# EAGLE design I2CHubMultiplexer (EAGLE 8.4.0)
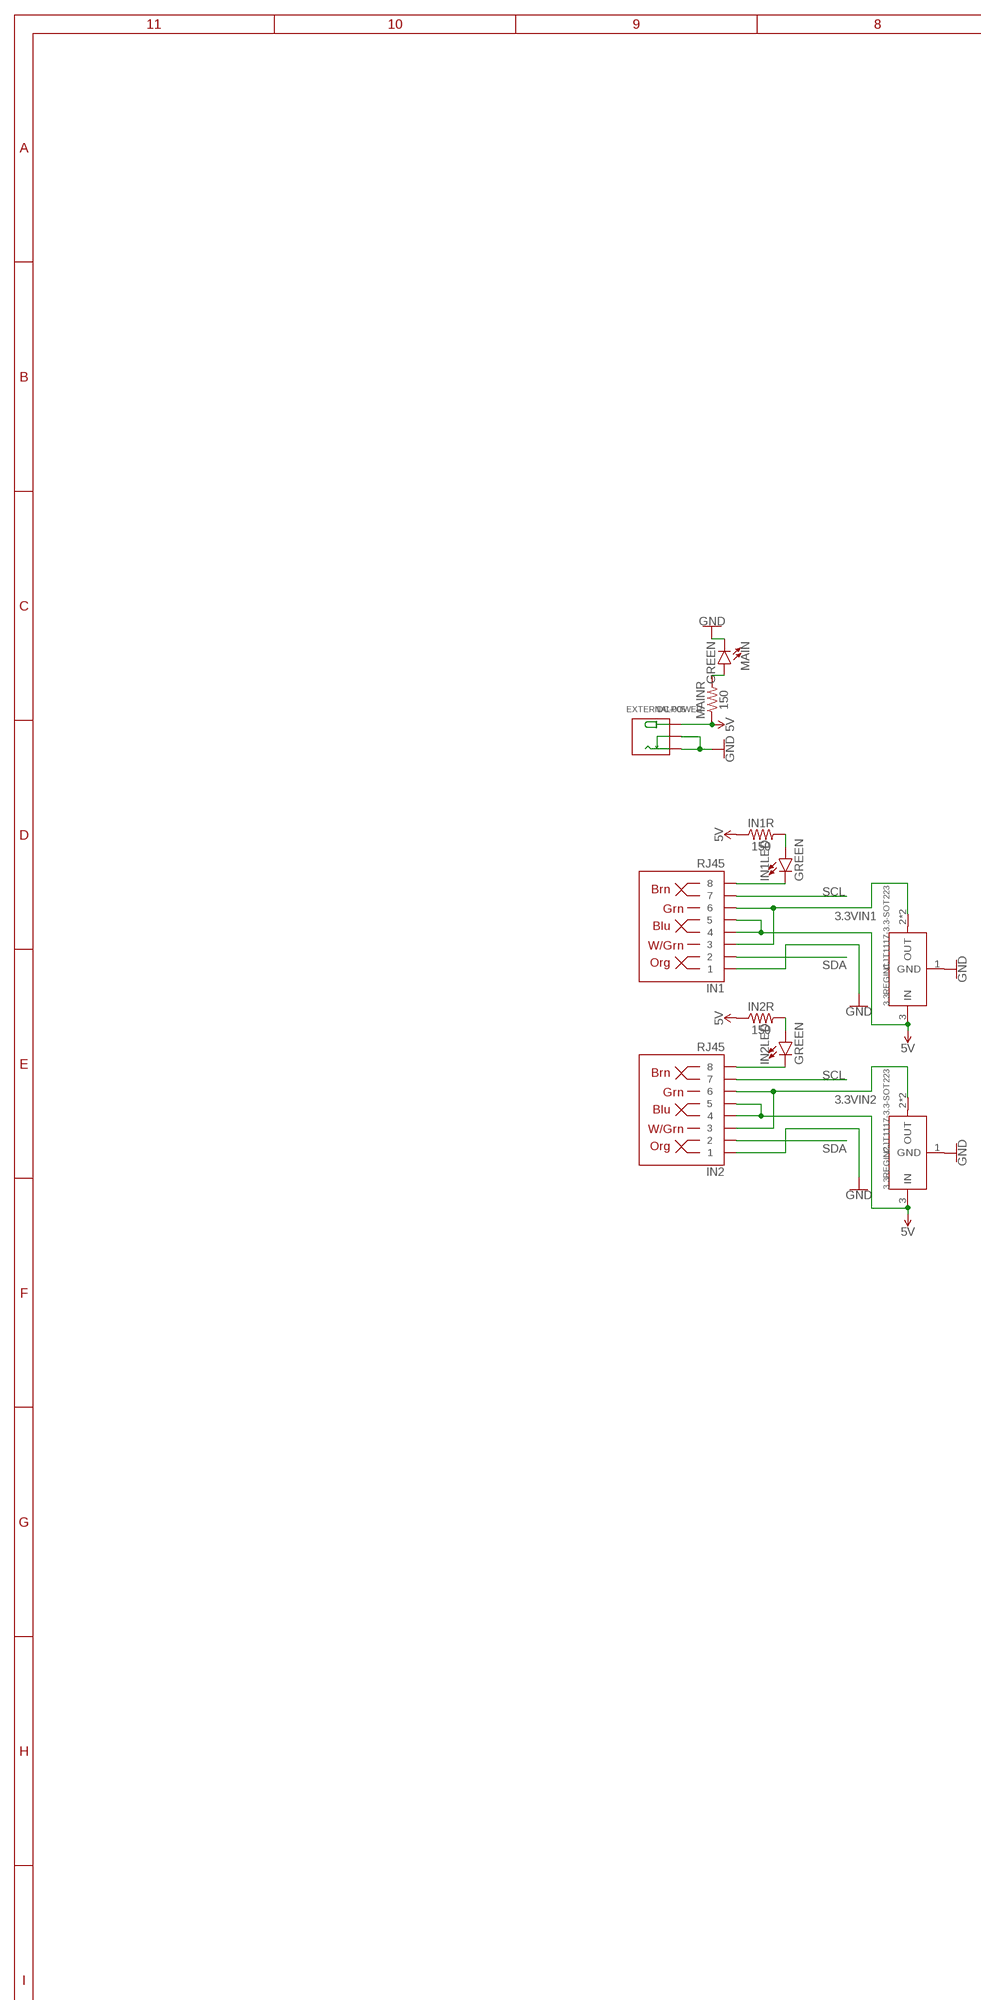
[diagram p0: schematic, sheet 1, part 1 of 2]
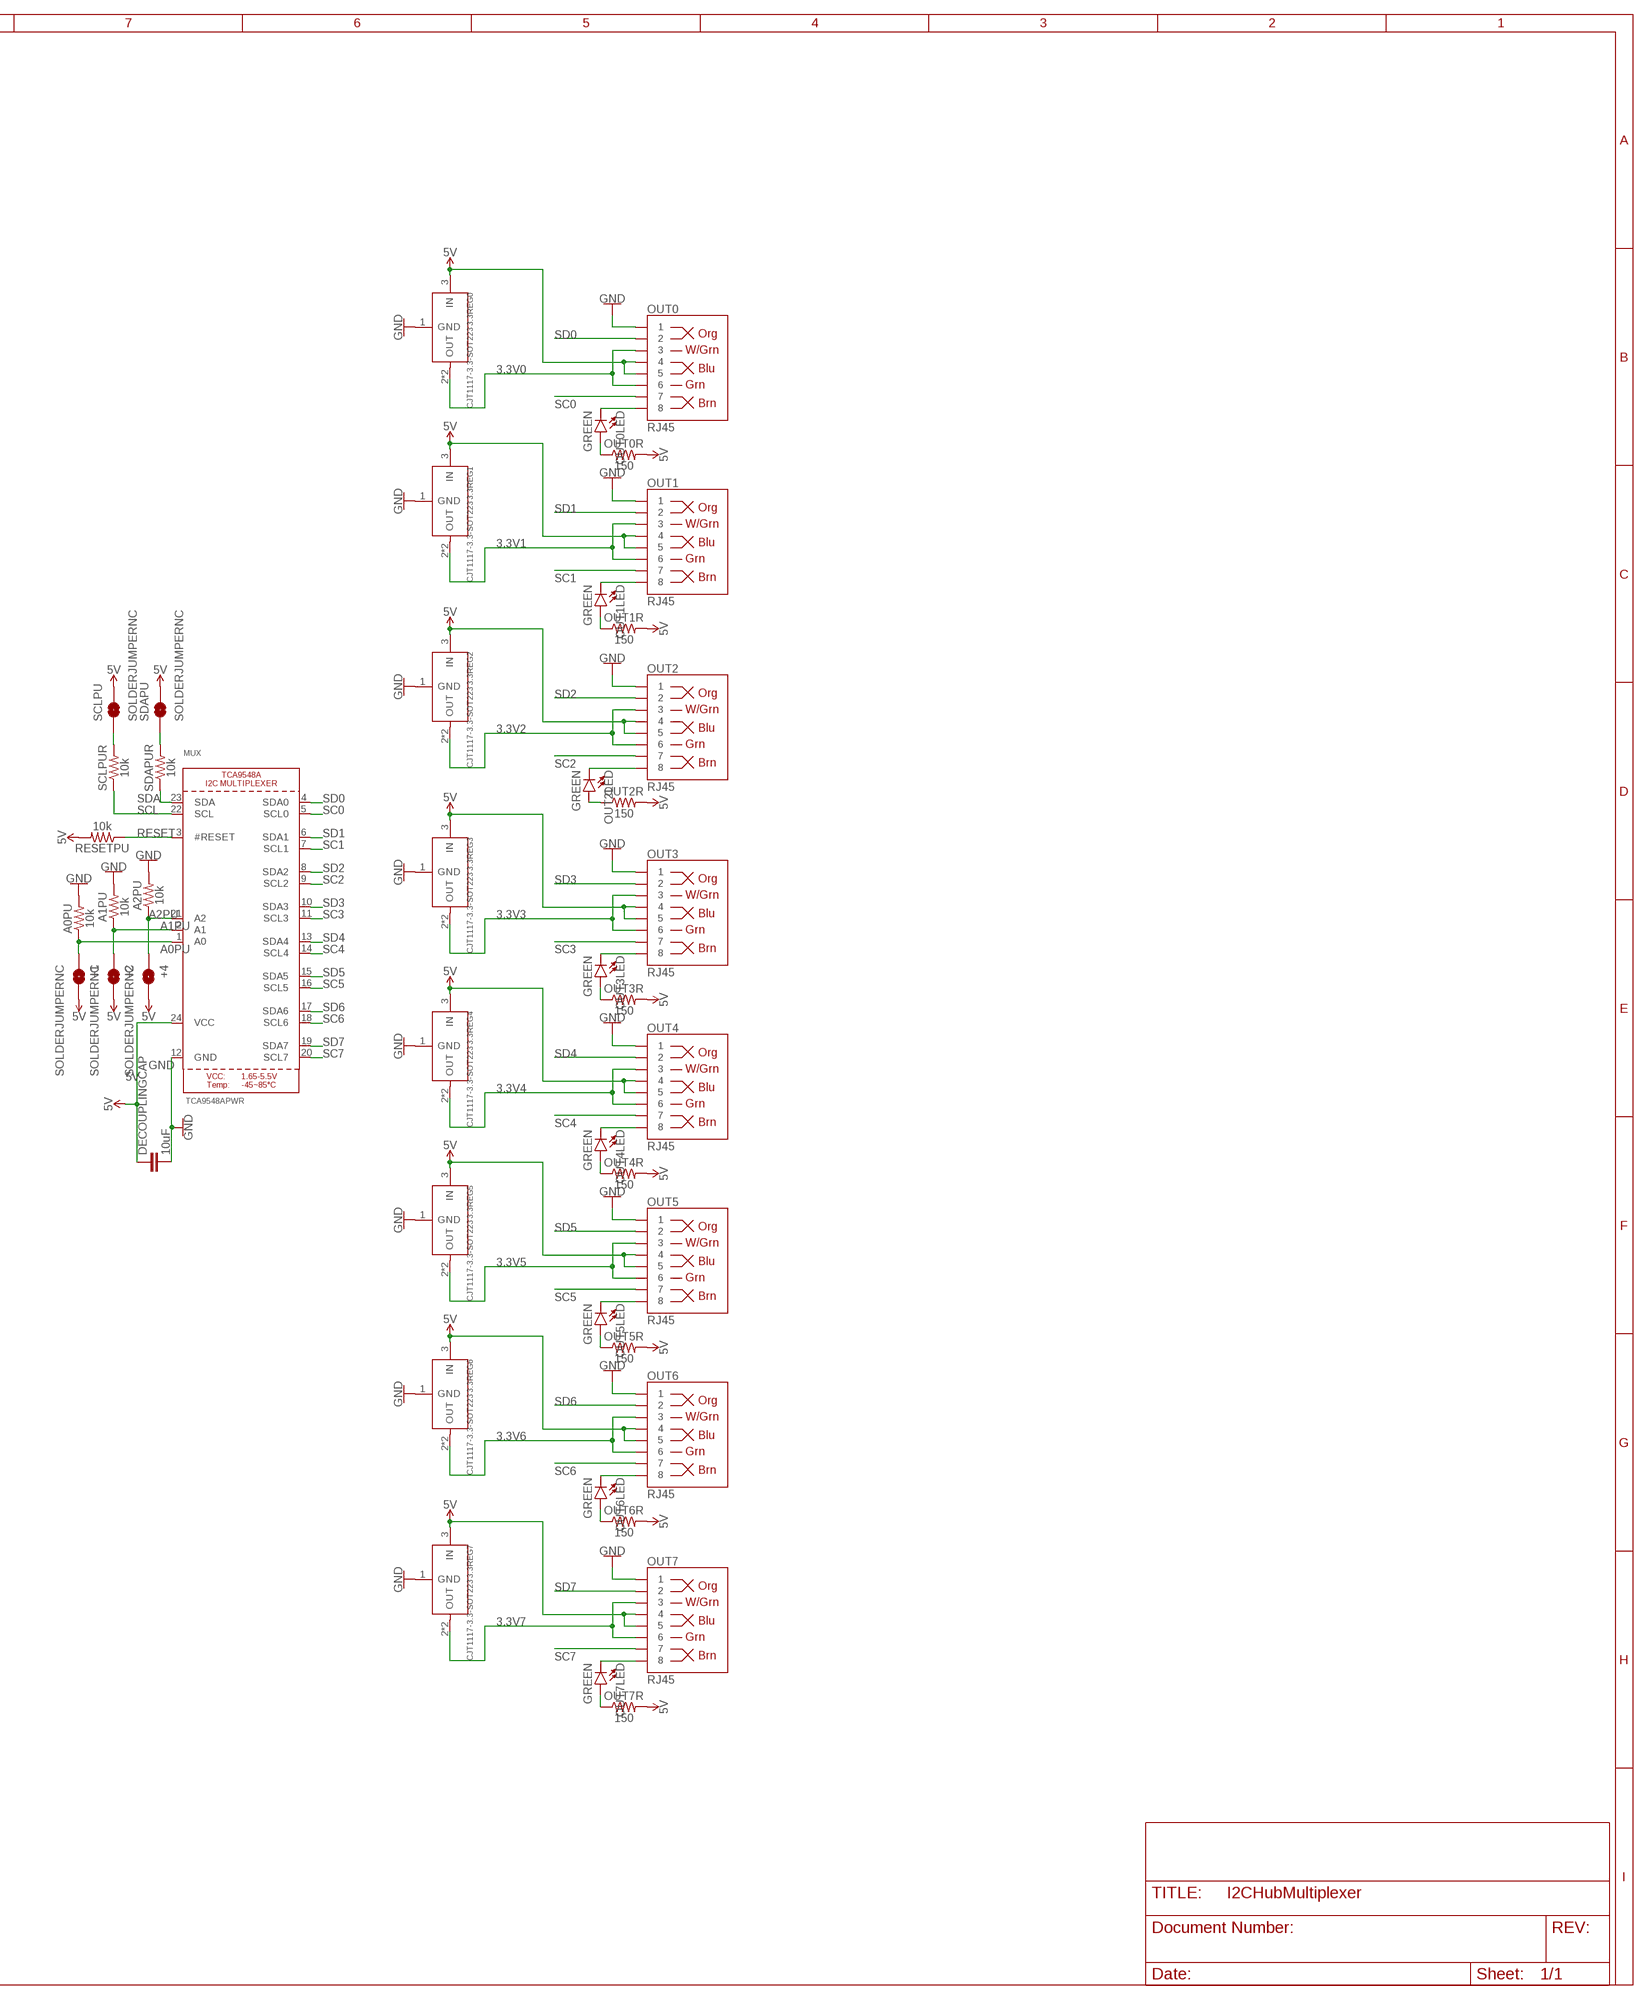
[diagram p1: schematic, sheet 1, part 2 of 2]

## Parts
3.3REG0  CJT1117-3.3-SOT223  PMIC-CJT1117-3.3(SOT223)  [SOT-223]
3.3REG1  CJT1117-3.3-SOT223  PMIC-CJT1117-3.3(SOT223)  [SOT-223]
3.3REG2  CJT1117-3.3-SOT223  PMIC-CJT1117-3.3(SOT223)  [SOT-223]
3.3REG3  CJT1117-3.3-SOT223  PMIC-CJT1117-3.3(SOT223)  [SOT-223]
3.3REG4  CJT1117-3.3-SOT223  PMIC-CJT1117-3.3(SOT223)  [SOT-223]
3.3REG5  CJT1117-3.3-SOT223  PMIC-CJT1117-3.3(SOT223)  [SOT-223]
3.3REG6  CJT1117-3.3-SOT223  PMIC-CJT1117-3.3(SOT223)  [SOT-223]
3.3REG7  CJT1117-3.3-SOT223  PMIC-CJT1117-3.3(SOT223)  [SOT-223]
3.3REGIN1  CJT1117-3.3-SOT223  PMIC-CJT1117-3.3(SOT223)  [SOT-223]
3.3REGIN2  CJT1117-3.3-SOT223  PMIC-CJT1117-3.3(SOT223)  [SOT-223]
+1  SOLDERJUMPERNC  [SJ_2S]
+2  SOLDERJUMPERNC  [SJ_2S]
+4  SOLDERJUMPERNC  [SJ_2S]
A0PU  10k  10KOHM-0603-1/10W-1%  [0603]
A1PU  10k  10KOHM-0603-1/10W-1%  [0603]
A2PU  10k  10KOHM-0603-1/10W-1%  [0603]
DECOUPLINGCAP  10uF  10UF-0603-6.3V-20%  [0603]
EXTERNALPOWER  DC-005  CONN-POWER-JACK-2.1MM(DC-005)  [DCJ3P-14.2X11.0X9.0MM]
IN1  RJ45  RJ45-8  [RJ45-8]
IN1LED  GREEN  LED-GREEN0603  [LED-0603]
IN1R  150  150OHM-0603-1/10W-1%  [0603]
IN2  RJ45  RJ45-8  [RJ45-8]
IN2LED  GREEN  LED-GREEN0603  [LED-0603]
IN2R  150  150OHM-0603-1/10W-1%  [0603]
MAIN  GREEN  LED-GREEN0603  [LED-0603]
MAINR  150  150OHM-0603-1/10W-1%  [0603]
MUX  TCA9548APWR  TCA9548A  [TSSOP24]
OUT0  RJ45  RJ45-8  [RJ45-8]
OUT0LED  GREEN  LED-GREEN0603  [LED-0603]
OUT0R  150  150OHM-0603-1/10W-1%  [0603]
OUT1  RJ45  RJ45-8  [RJ45-8]
OUT1LED  GREEN  LED-GREEN0603  [LED-0603]
OUT1R  150  150OHM-0603-1/10W-1%  [0603]
OUT2  RJ45  RJ45-8  [RJ45-8]
OUT2LED  GREEN  LED-GREEN0603  [LED-0603]
OUT2R  150  150OHM-0603-1/10W-1%  [0603]
OUT3  RJ45  RJ45-8  [RJ45-8]
OUT3LED  GREEN  LED-GREEN0603  [LED-0603]
OUT3R  150  150OHM-0603-1/10W-1%  [0603]
OUT4  RJ45  RJ45-8  [RJ45-8]
OUT4LED  GREEN  LED-GREEN0603  [LED-0603]
OUT4R  150  150OHM-0603-1/10W-1%  [0603]
OUT5  RJ45  RJ45-8  [RJ45-8]
OUT5LED  GREEN  LED-GREEN0603  [LED-0603]
OUT5R  150  150OHM-0603-1/10W-1%  [0603]
OUT6  RJ45  RJ45-8  [RJ45-8]
OUT6LED  GREEN  LED-GREEN0603  [LED-0603]
OUT6R  150  150OHM-0603-1/10W-1%  [0603]
OUT7  RJ45  RJ45-8  [RJ45-8]
OUT7LED  GREEN  LED-GREEN0603  [LED-0603]
OUT7R  150  150OHM-0603-1/10W-1%  [0603]
RESETPU  10k  10KOHM-0603-1/10W-1%  [0603]
SCLPU  SOLDERJUMPERNC  [SJ_2S]
SCLPUR  10k  10KOHM-0603-1/10W-1%  [0603]
SDAPU  SOLDERJUMPERNC  [SJ_2S]
SDAPUR  10k  10KOHM-0603-1/10W-1%  [0603]

## Nets
3.3V0: 3.3REG0.2(OUT) 3.3REG0.TER(OUT) OUT0.3 OUT0.6
3.3V1: 3.3REG1.2(OUT) 3.3REG1.TER(OUT) OUT1.3 OUT1.6
3.3V2: 3.3REG2.2(OUT) 3.3REG2.TER(OUT) OUT2.3 OUT2.6
3.3V3: 3.3REG3.2(OUT) 3.3REG3.TER(OUT) OUT3.3 OUT3.6
3.3V4: 3.3REG4.2(OUT) 3.3REG4.TER(OUT) OUT4.3 OUT4.6
3.3V5: 3.3REG5.2(OUT) 3.3REG5.TER(OUT) OUT5.3 OUT5.6
3.3V6: 3.3REG6.2(OUT) 3.3REG6.TER(OUT) OUT6.3 OUT6.6
3.3V7: 3.3REG7.2(OUT) 3.3REG7.TER(OUT) OUT7.3 OUT7.6
3.3VIN1: 3.3REGIN1.2(OUT) 3.3REGIN1.TER(OUT) IN1.3 IN1.6
3.3VIN2: 3.3REGIN2.2(OUT) 3.3REGIN2.TER(OUT) IN2.3 IN2.6
5V: 3.3REG0.3(IN) 3.3REG1.3(IN) 3.3REG2.3(IN) 3.3REG3.3(IN) 3.3REG4.3(IN) 3.3REG5.3(IN) 3.3REG6.3(IN) 3.3REG7.3(IN) 3.3REGIN1.3(IN) 3.3REGIN2.3(IN) +1.2 +2.2 +4.2 DECOUPLINGCAP.1 EXTERNALPOWER.+ IN1.4 IN1.5 IN1R.1 IN2.4 IN2.5 IN2R.1 MAINR.1 MUX.24(VCC) OUT0.4 OUT0.5 OUT0R.2 OUT1.4 OUT1.5 OUT1R.2 OUT2.4 OUT2.5 OUT2R.2 OUT3.4 OUT3.5 OUT3R.2 OUT4.4 OUT4.5 OUT4R.2 OUT5.4 OUT5.5 OUT5R.2 OUT6.4 OUT6.5 OUT6R.2 OUT7.4 OUT7.5 OUT7R.2 RESETPU.2 SCLPU.2 SDAPU.2
A0PU: +1.1 A0PU.1 MUX.1(A0)
A1PU: +2.1 A1PU.1 MUX.2(A1)
A2PU: +4.1 A2PU.1 MUX.21(A2)
GND: 3.3REG0.1(GND) 3.3REG1.1(GND) 3.3REG2.1(GND) 3.3REG3.1(GND) 3.3REG4.1(GND) 3.3REG5.1(GND) 3.3REG6.1(GND) 3.3REG7.1(GND) 3.3REGIN1.1(GND) 3.3REGIN2.1(GND) A0PU.2 A1PU.2 A2PU.2 DECOUPLINGCAP.2 EXTERNALPOWER.-1(-) EXTERNALPOWER.-2(CDN) IN1.1 IN2.1 MAIN.C MUX.12(GND) OUT0.1 OUT1.1 OUT2.1 OUT3.1 OUT4.1 OUT5.1 OUT6.1 OUT7.1
IN1LEDR: IN1LED.A IN1R.2
IN2LEDR: IN2LED.A IN2R.2
MAINLEDR: MAIN.A MAINR.2
OU1LEDR: OUT1LED.A OUT1R.1
OUT0LEDR: OUT0LED.A OUT0R.1
OUT2LEDR: OUT2LED.A OUT2R.1
OUT3LEDR: OUT3LED.A OUT3R.1
OUT4LEDR: OUT4LED.A OUT4R.1
OUT5LEDR: OUT5LED.A OUT5R.1
OUT6LEDR: OUT6LED.A OUT6R.1
OUT7LEDR: OUT7LED.A OUT7R.1
RESET: MUX.3(#RESET) RESETPU.1
RETRUNGNDIN1: IN1.8 IN1LED.C
RETURNGNDIN2: IN2.8 IN2LED.C
RETURNGNDOUT1: OUT1.8 OUT1LED.C
RETURNGNDOUT2: OUT2.8 OUT2LED.C
RETURNGNDOUT3: OUT3.8 OUT3LED.C
RETURNGNDOUT4: OUT4.8 OUT4LED.C
RETURNGNDOUT5: OUT5.8 OUT5LED.C
RETURNGNDOUT6: OUT6.8 OUT6LED.C
RETURNGNDOUT7: OUT7.8 OUT7LED.C
RETURNGRNDOUT0: OUT0.8 OUT0LED.C
SC0: MUX.5(SCL0) OUT0.7
SC1: MUX.7(SCL1) OUT1.7
SC2: MUX.9(SCL2) OUT2.7
SC3: MUX.11(SCL3) OUT3.7
SC4: MUX.14(SCL4) OUT4.7
SC5: MUX.16(SCL5) OUT5.7
SC6: MUX.18(SCL6) OUT6.7
SC7: MUX.20(SCL7) OUT7.7
SCL: IN1.7 IN2.7 MUX.22(SCL) SCLPUR.1
SCLPU: SCLPU.1 SCLPUR.2
SD0: MUX.4(SDA0) OUT0.2
SD1: MUX.6(SDA1) OUT1.2
SD2: MUX.8(SDA2) OUT2.2
SD3: MUX.10(SDA3) OUT3.2
SD4: MUX.13(SDA4) OUT4.2
SD5: MUX.15(SDA5) OUT5.2
SD6: MUX.17(SDA6) OUT6.2
SD7: MUX.19(SDA7) OUT7.2
SDA: IN1.2 IN2.2 MUX.23(SDA) SDAPUR.1
SDAPU: SDAPU.1 SDAPUR.2

## Library data of the parts
3.3REG0 3.3REG1-3.3REG7 3.3REGIN1 3.3REGIN2 = Seeed-IC:PMIC-CJT1117-3.3(SOT223): 310030097; MPN: CJT1117-3.3
+1 +2 +4 SCLPU SDAPU = SparkFun-Retired:SOLDERJUMPER: Solder Jumper Standard SMD solder jumper. Used to automate production. Two varients : Normally Open and Normally Closed are the same, but have different paste layers. NC will have a large amount of paste and should jumper during reflow.
A0PU A1PU A2PU RESETPU SCLPUR SDAPUR = SparkFun-Resistors:10KOHM: 10kΩ resistor A resistor is a passive two-terminal electrical component that implements electrical resistance as a circuit element. Resistors act to reduce current flow, and, at the same time, act to lower voltage levels within circuits. - Wikipedia; PROD_ID: RES-00824
DECOUPLINGCAP = SparkFun-Capacitors:10UF: 10.0µF ceramic capacitors A capacitor is a passive two-terminal electrical component used to store electrical energy temporarily in an electric field.; PROD_ID: CAP-11015
EXTERNALPOWER = Seeed-Connector:CONN-POWER-JACK-2.1MM(DC-005): 320120003; MPN: DC-005
IN1 IN2 OUT0 OUT1-OUT7 = SparkFun-Connectors:RJ45-8: RJ45 Jack - 8 pin Simple RJ45, 8-pin connection. Commonly used for Cat5, Cat5e, and Cat6 Ethernet cables. Here is the connector we sell at SparkFun: RJ45 8-Pin Connector <https://www.sparkfun.com/products/643> (PRT-00643) Datasheet <https://cdn.sparkfun.com/datasheets/Prototyping/04908.pdf> It is used on this SparkFun product: SparkFun RJ45 Breakout <https://www.sparkfun.com/products/716> (BOB-00716) Note, you may also be interested in the "MAGJACK" version of this. It is basically a RJ45 connector, but also has some status LEDs built into the connector housing. You can check that out in this library at the device named "MAGJACK.dev" and see these products online: RJ45 Ethernet MagJack-Compatible <https://www.sparkfun.com/products/8534> (PRT-08534) SparkFun RJ45 MagJack Breakout <https://www.sparkfun.com/products/13021> (BOB-13021); PROD_ID: CONN-08506; SF_ID: PRT-00643
IN1LED IN2LED MAIN OUT0LED OUT1LED OUT2LED OUT3LED OUT4LED OUT5LED OUT6LED OUT7LED = SparkFun-LED:LED-GREEN: Green SMD LED Used in manufacturing of various products at SparkFun Packages: 0603 - SMD 0603 package [Product Link] <http://www.futureelectronics.com/en/technologies/semiconductors/optoelectronics/leds/Pages/9894312-LTST-C190GKT.aspx?CrossPart=HSMG-C190&IM=0> LilyPad 1206 - SMD1206 LilyPad package [Product Link] <http://www.futureelectronics.com/en/Technologies/Product.aspx?ProductID=IN150NGHARVATEKCORPORATION2049943&IM=0> 1206 - SMD1206 package [Product Link] <http://www.futureelectronics.com/en/technologies/semiconductors/optoelectronics/leds/Pages/8315665-LTST-C150KGKT.aspx?IM=0> 1206 Bottom Mount -SMD 1206 Bottom Mount [Product Link] <http://www.digikey.com/product-detail/en/lite-on-inc/LTST-C230KGKT/160-1456-1-ND/386854> SparkFun Products: Pro Mini 328 -5V <https://www.sparkfun.com/products/821> RedBoard <https://www.sparkfun.com/products/12757> MP3 Trigger <https://www.sparkfun.com/products/13720> Makey Makey <https://www.sparkfun.com/products/11076>; PROD_ID: DIO-00821
IN1R IN2R MAINR OUT0R OUT1R OUT2R OUT3R OUT4R OUT5R OUT6R OUT7R = SparkFun-Resistors:150OHM: 150Ω resistor A resistor is a passive two-terminal electrical component that implements electrical resistance as a circuit element. Resistors act to reduce current flow, and, at the same time, act to lower voltage levels within circuits. - Wikipedia; PROD_ID: RES-11028
MUX = microbuilder:TCA9548A: TCA9548A I2C Multiplexer

## Board
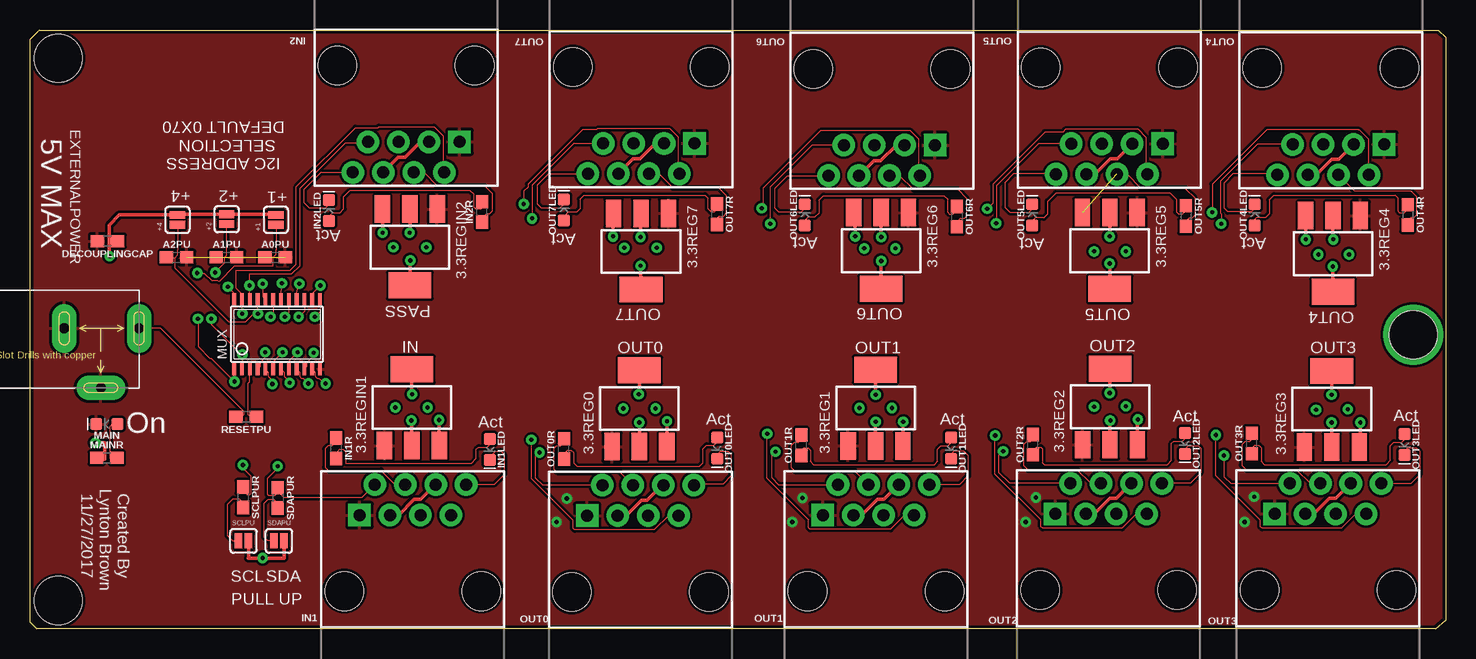
[diagram p2: board, top side]
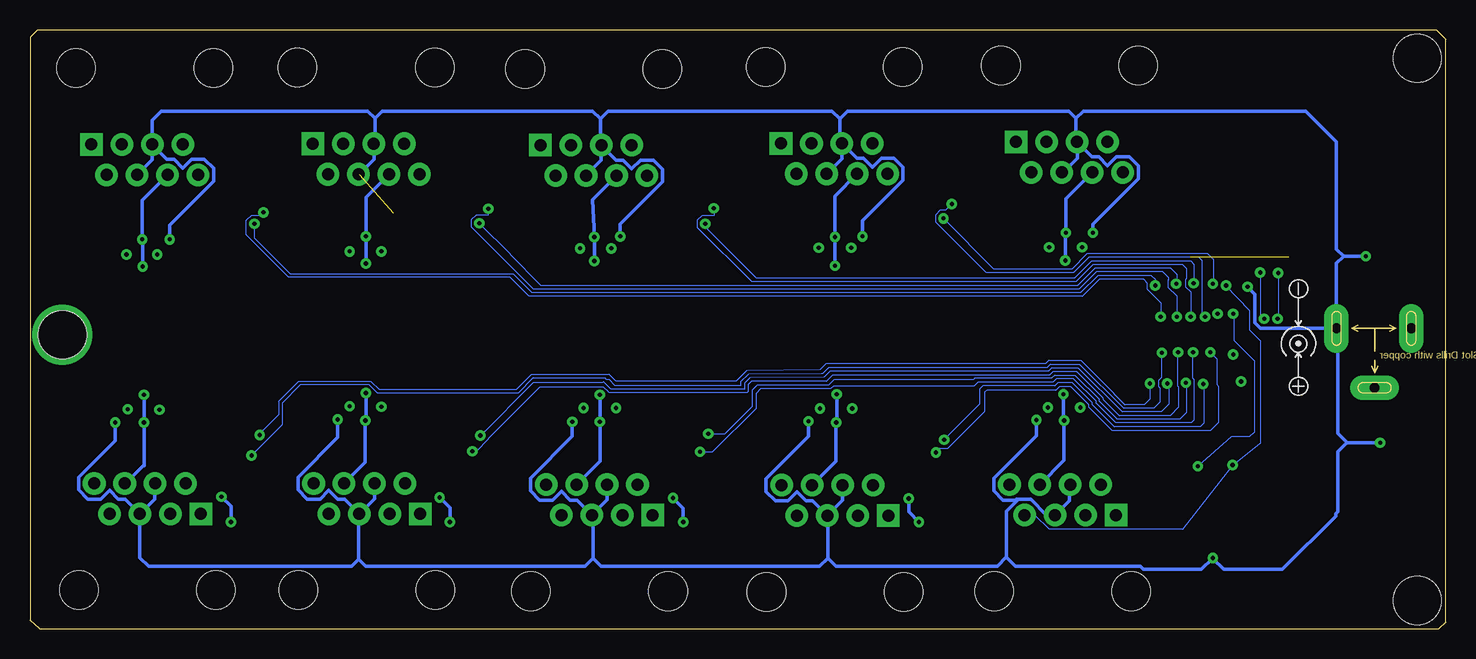
[diagram p3: board, bottom side, seen from below]

Size 118 x 49.9 mm. Coordinates in mm from the lower left corner, seen from the top.
Outline: 0,0.55 0,49.15 0.75,49.9 117.4,49.9 118,49.3 118,0.7 117.2,0 0.55,0 0,0.55
Copper layers (1*16): Top 0.035mm / dielectric 1.5mm / Bottom 0.035mm
Design rules "SparkFun": minimum track width 8mil, minimum drill 20mil, track to track 8mil, track to pad 8mil, pad to pad 8mil, via to via 8mil, smd to smd 8mil, copper to edge 10mil, drill to drill 8mil, minimum pad ring 12mil, minimum via ring 10mil, stop-mask expansion 4mil, vias tented up to drill 25mil, thermal gap 10mil
Holes 4 mm at 2.35,47.55 2.35,2.35 115.3,24.5

### Footprints (pad centres in the part's own frame; a part is rotated, then mirrored left to right if it is on the bottom)
SOT-223 = smd 1.27 x 2.286: 1 -2.286,-3.175; 2 0,-3.175; 3 2.286,-3.175 | smd 3.556 x 2.159: TER 0,3.175
SJ_2S = smd 0.635 x 1.27: 1 -0.412,0; 2 0.412,0
0603 = smd 1.1 x 1: 1 -0.85,0; 2 0.85,0
DCJ3P-14.2X11.0X9.0MM = drill 0.813 pad 2.032 long: + 3.175,0; -1 -3.048,0; -2 0,-4.953
RJ45-8 = drill 1 pad 1.88 square: 1 -4.445,6.35 | drill 1 pad 1.88: 2 -3.175,8.89; 3 -1.905,6.35; 4 -0.635,8.89; 5 0.635,6.35; 6 1.905,8.89; 7 3.175,6.35; 8 4.445,8.89 | hole 3.2: -5.715,0; 5.715,0
LED-0603 = smd 1 x 1: A -0.877,0; C 0.877,0
TSSOP24 = smd 0.305 x 0.991: 1 -3.575,-2.918; 2 -2.925,-2.918; 3 -2.275,-2.918; 4 -1.625,-2.918; 5 -0.975,-2.918; 6 -0.325,-2.918; 7 0.325,-2.918; 8 0.975,-2.918; 9 1.625,-2.918; 10 2.275,-2.918; 11 2.925,-2.918; 12 3.575,-2.918; 13 3.575,2.918; 14 2.925,2.918; 15 2.275,2.918; 16 1.625,2.918; 17 0.975,2.918; 18 0.325,2.918; 19 -0.325,2.918; 20 -0.975,2.918; 21 -1.625,2.918; 22 -2.275,2.918; 23 -2.925,2.918; 24 -3.575,2.918

### Placement (x,y rotation side)
3.3REG0  50.8,18.36 0 top
3.3REG1  70.49,18.41 0 top
3.3REG2  90.03,18.51 0 top
3.3REG3  108.52,18.31 0 top
3.3REG4  108.62,31.25 180 top
3.3REG5  90.01,31.5 180 top
3.3REG6  70.95,31.5 180 top
3.3REG7  50.94,31.45 180 top
3.3REGIN1  31.83,18.45 0 top
3.3REGIN2  31.67,31.8 180 top
+1  20.5,34.08 90 top
+2  16.4,34.13 90 top
+4  12.3,34.08 90 top
A0PU  20.44,30.96 0 top
A1PU  16.38,30.96 0 top
A2PU  12.22,30.96 0 top
DECOUPLINGCAP  6.47,32.31 180 top
EXTERNALPOWER  5.91,25.04 0 top
IN1  31.91,3.13 0 top
IN1LED  38.35,14.95 270 top
IN1R  25.5,15.05 270 top
IN2  31.35,46.93 180 top
IN2LED  24.9,34.85 90 top
IN2R  37.7,34.75 90 top
MAIN  6.4,17.05 180 top
MAINR  6.4,14.25 0 top
MUX  20.6,24.55 0 top
OUT0  50.89,3.08 0 top
OUT0LED  57.3,15.05 270 top
OUT0R  44.5,15 90 top
OUT1  70.53,3.13 0 top
OUT1LED  76.8,15.05 270 top
OUT1R  64.3,15.3 90 top
OUT2  89.91,3.22 0 top
OUT2LED  96.3,15.45 270 top
OUT2R  83.6,15.35 90 top
OUT3  108.2,3.22 0 top
OUT3LED  114.6,15.35 270 top
OUT3R  101.85,15.45 90 top
OUT4  108.44,46.72 180 top
OUT4LED  102.1,34.5 90 top
OUT4R  114.85,34.5 270 top
OUT5  89.98,46.77 180 top
OUT5LED  83.55,34.5 90 top
OUT5R  96.35,34.4 270 top
OUT6  71.01,46.66 180 top
OUT6LED  64.6,34.5 90 top
OUT6R  77.25,34.35 270 top
OUT7  50.95,46.81 180 top
OUT7LED  44.5,34.9 90 top
OUT7R  57.25,34.55 270 top
RESETPU  18.02,17.66 180 top
SCLPU  17.8,7.33 0 top
SCLPUR  17.75,10.96 270 top
SDAPU  20.75,7.33 0 top
SDAPUR  20.66,10.91 270 top

### Tracks (layer width: path | path; a pad name or v marks a point on that pad's centre or on a via)
3.3V0  (via drill 0.35)
  Top 0.102: 52.7,11.97 OUT0.6
  Top 0.305: 52.7,11.97 51.45,10.72 50.99,10.72 49.69,9.43 OUT0.3 | 3.3REG0.2 v50.8,17.2 | 3.3REG0.TER 50.8,19.55 v50.75,19.55
  Bottom 0.305: OUT0.6 50.8,13.96 v50.8,17.2 50.75,17.2 v50.75,19.55
3.3V1  (via drill 0.35)
  Top 0.305: OUT1.6 71.19,10.78 70.63,10.78 69.33,9.48 OUT1.3 | 3.3REG1.2 v70.49,17.24 v70.5,17.25 | 3.3REG1.TER v70.49,19.5 v70.5,19.5
  Bottom 0.305: OUT1.6 70.5,13.96 v70.5,17.25 v70.5,19.5
3.3V2  (via drill 0.35)
  Top 0.305: OUT2.6 90.57,10.87 90.01,10.87 88.71,9.57 OUT2.3 | 3.3REG2.2 90.03,17.33 v90.05,17.35 | 3.3REG2.TER 90.03,19.65 v90,19.65
  Bottom 0.305: 90.05,17.25 v90.05,17.35 | 90.05,17.25 90.05,13.88 OUT2.6 | v90,19.65 90,17.25 90.05,17.25
3.3V3  (via drill 0.35)
  Top 0.305: OUT3.6 108.86,10.87 108.3,10.87 107,9.57 OUT3.3 | 3.3REG3.2 108.52,17.18 v108.5,17.2 | 3.3REG3.TER 108.52,19.5 v108.5,19.5
  Bottom 0.305: OUT3.6 110.04,12.11 108.55,13.6 108.5,13.6 v108.5,17.2 v108.5,19.5
3.3V4  (via drill 0.35)
  Top 0.102: OUT4.3
  Top 0.305: OUT4.3 109.1,39.12 108.54,39.12 107.24,37.83 OUT4.6 | 3.3REG4.2 108.62,32.48 v108.65,32.45 | 3.3REG4.TER 108.62,30.2 v108.6,30.2
  Bottom 0.305: OUT4.6 108.65,35.72 v108.65,32.45 108.6,32.45 v108.6,30.2
3.3V5  (via drill 0.35)
  Top 0.305: OUT5.3 90.64,39.17 90.08,39.17 88.78,37.88 OUT5.6 | 3.3REG5.2 v90.01,32.71 v90,32.7 | 3.3REG5.TER v90.01,30.45 v90,30.45
  Bottom 0.305: OUT5.6 90,35.95 v90,32.7 v90,30.45
3.3V6  (via drill 0.35)
  Top 0.102: 72.88,40.27 OUT6.3
  Top 0.305: OUT6.6 70.35,39.02 70.91,39.02 72.17,40.27 72.88,40.27 | 3.3REG6.2 v70.95,32.65 | 3.3REG6.TER v70.95,30.65
  Bottom 0.305: OUT6.6 71.1,35.77 v70.95,32.65 v70.95,30.65
3.3V7  (via drill 0.35)
  Top 0.102: 52.82,40.43 OUT7.3
  Top 0.305: OUT7.6 50.29,39.16 50.85,39.16 52.11,40.43 52.82,40.43 | 3.3REG7.2 50.89,33.01 v50.9,32.65 | 3.3REG7.TER 50.89,30.6 v50.9,30.25
  Bottom 0.305: OUT7.6 50.9,36.06 v50.9,32.65 v50.9,30.25
3.3VIN1  (via drill 0.35)
  Top 0.305: IN1.6 32.57,10.78 32.01,10.78 30.71,9.48 IN1.3 | 3.3REGIN1.2 31.83,17.32 v31.8,17.35 | 3.3REGIN1.TER 31.83,19.55 v31.85,19.55
  Bottom 0.305: IN1.6 31.8,14.04 v31.8,17.35 31.85,17.35 v31.85,19.55
3.3VIN2  (via drill 0.35)
  Top 0.305: IN2.6 30.69,39.28 31.25,39.28 32.55,40.58 IN2.3 | 3.3REGIN2.2 31.67,33.02 v31.65,33 | 3.3REGIN2.TER 31.67,30.7 v31.7,30.7
  Bottom 0.305: IN2.6 31.65,35.84 v31.65,33 31.7,33 v31.7,30.7
5V  (via drill 0.35)  (1 unrouted)
  Top 0.102: MUX.24 17.02,27.98 v16.5,28.5 | OUT4.4 110.45,36.45 115.15,36.45 115.6,36.01 115.6,34.5 115.4,34.3 115.15,34.3 114.85,34 OUT4R.2 | OUT5.4 91.47,37.88 92.66,36.69 96.32,36.69 97.1,35.91 97.1,34.45 96.85,34.2 96.6,34.2 96.35,33.95 OUT5R.2 | OUT6.4 72.5,37.77 73.69,36.58 77.38,36.58 78.1,35.85 78.1,34.4 77.9,34.2 77.55,34.2 77.25,33.9 OUT6R.2 | OUT7.4 52.44,37.92 53.63,36.73 57.43,36.73 58.05,36.1 58.05,34.65 57.8,34.4 57.45,34.4 57.25,34.2 OUT7R.2 | IN2.4 32.84,38.04 34.03,36.85 37.96,36.85 38.55,36.26 38.55,34.85 38.3,34.6 38.05,34.6 37.8,34.35 37.8,34 IN2R.1 | IN1.4 30.42,12.02 29.23,13.21 24.85,13.21 24.6,13.46 24.6,15 24.85,15.25 25.2,15.25 25.5,15.55 IN1R.1 | OUT1.4 68.7,13.21 66.86,13.21 66.8,13.15 63.75,13.15 63.45,13.45 63.45,15.25 63.7,15.5 64,15.5 64.25,15.75 64.25,16.1 OUT1R.2 | OUT2.4 88.42,12.11 87.23,13.3 86.24,13.3 86.19,13.25 83.2,13.25 82.8,13.65 82.8,15.35 83,15.55 83.35,15.55 83.6,15.8 OUT2R.2 | OUT3.4 106.71,12.11 105.52,13.3 104.53,13.3 104.48,13.25 101.4,13.25 101,13.65 101,15.35 101.25,15.6 101.65,15.6 101.85,15.8 OUT3R.2 | EXTERNALPOWER.+ 10.9,25.04 17.85,18.09 17.85,17.9 17.61,17.66 RESETPU.2 | OUT0R.2 44.5,15.51 44.2,15.21 43.85,15.21 43.65,15.01 43.65,13.35 43.95,13.05 47.11,13.05 47.22,13.16 49.06,13.16 OUT0.4
  Top 0.305: v5.45,15.5 6.24,15.5 6.24,14.15 5.65,14.15 MAINR.1 | DECOUPLINGCAP.1 7.32,32.25 6.6,32.25 | 6.6,32.25 6.6,31.05 v6.65,31.05 | +1.2 20.5,34.54 +2.2 12.3,34.54 +4.2 7.45,34.5 6.6,33.65 6.6,32.25 | SCLPU.2 18.21,5.91 18.2,5.9 v19.4,5.9 21.2,5.9 21.2,7.29 SDAPU.2 | 3.3REGIN2.3 29.38,33.02 v29.4,33 | 3.3REG7.3 48.6,33 v48.6,32.7 | 3.3REG6.3 68.81,33.01 v68.8,32.7 | 3.3REG4.3 106.33,32.47 v106.35,32.45 | 3.3REG3.3 110.9,15.23 v110.9,17.2 | 3.3REG2.3 92.32,17.42 v92.35,17.45 | 3.3REG1.3 72.78,17.23 v72.8,17.25 | 3.3REG0.3 53.09,17.29 v53.1,17.3 | 3.3REGIN1.3 34.12,17.38 v34.1,17.4
  Bottom 0.102: 31.86,38.04 IN2.4
  Bottom 0.305: v5.45,15.5 8.2,15.5 | v6.65,31.05 8.5,31.05 | EXTERNALPOWER.+ 9,25.04 9,16.3 8.2,15.5 | 31.86,38.04 30.7,39.2 30.7,40.56 | 30.7,40.56 arc-90 IN2.5 30.8,40.66 30.8,42.55 | OUT7.5 50.31,39.19 OUT7.4 | OUT6.5 70.38,39.03 OUT6.4 | OUT5.4 90.57,37.88 89.3,39.15 89.3,40.38 OUT5.5 89.25,40.52 89.25,42.55 | 107.83,40.35 OUT4.5 107.81,42.4 107.05,43.15 89.85,43.15 89.25,42.55 | 107.83,40.35 107.83,39.08 OUT4.4 | OUT3.4 107.6,12.07 107.6,10.8 OUT3.5 | OUT2.4 89.28,10.84 OUT2.5 | OUT1.4 69.89,10.75 OUT1.5 | OUT0.4 50.26,10.7 OUT0.5 | IN1.4 31.34,11.96 31.34,10.69 IN1.5 33.25,9.48 34.55,10.78 35.62,10.78 | 30.7,40.56 29.47,39.34 28.91,39.34 28.18,38.6 27.44,39.34 26.37,39.34 25.61,38.58 25.61,37.5 29.4,33.71 v29.4,33 | OUT7.5 49.07,39.22 48.51,39.22 47.77,38.48 47.04,39.22 45.97,39.22 45.21,38.46 45.21,37.38 48.6,33.99 v48.6,32.7 | OUT6.5 69.13,39.06 68.57,39.06 67.83,38.33 67.1,39.06 66.03,39.06 65.27,38.31 65.27,37.23 68.8,33.7 v68.8,32.7 | 107.83,40.35 106.61,39.12 106,39.12 105.27,38.39 104.53,39.12 103.46,39.12 102.7,38.37 102.7,37.29 106.35,33.64 v106.35,32.45 | OUT3.5 110.08,10.81 110.64,10.81 111.38,11.55 112.11,10.81 113.18,10.81 113.94,11.57 113.94,12.65 110.9,15.69 v110.9,17.2 | OUT2.5 91.79,10.81 92.35,10.81 93.08,11.55 93.82,10.81 94.89,10.81 95.65,11.57 95.65,12.65 92.35,15.95 v92.35,17.45 | OUT1.5 72.41,10.72 72.97,10.72 73.7,11.46 74.44,10.72 75.51,10.72 76.27,11.48 76.27,12.56 72.8,16.03 v72.8,17.25 | OUT0.5 52.77,10.68 53.33,10.68 54.06,11.41 54.8,10.68 55.87,10.68 56.63,11.43 56.63,12.51 53.1,16.04 v53.1,17.3 | OUT6.5 70.45,40.38 70.45,42.5
  Bottom 0.305: OUT7.5 50.5,40.65 50.5,42.5 | OUT2.5 90.6,9.52 90.6,5.8 | OUT1.5 71.05,9.37 71.05,5.9 | OUT0.5 51.5,9.4 51.5,5.9 | 35.62,10.78 36.6,9.8 36.6,6 | v34.1,17.4 34.1,16.11 37.65,12.56 37.65,11.48 36.89,10.72 35.82,10.72 35.77,10.78 35.62,10.78 | EXTERNALPOWER.+ 15.44,25.05 15.9,25.51 15.9,27.9 v16.5,28.5 | 8.5,31.05 9.1,31.65 9.1,40.6 11.65,43.15 30.2,43.15 30.8,42.55 | 8.5,31.05 9.1,30.45 EXTERNALPOWER.+ | 30.8,42.55 31.4,43.15 49.85,43.15 50.5,42.5 | 50.5,42.5 51.15,43.15 69.8,43.15 70.45,42.5 | 70.45,42.5 71.1,43.15 88.65,43.15 89.25,42.55 | OUT3.5 108.83,5.93 108.1,5.2 103.34,5.2 103.32,5.23 91.17,5.23 90.6,5.8 | 90.6,5.8 90.03,5.23 71.72,5.23 71.05,5.9 | 71.05,5.9 70.38,5.23 52.17,5.23 51.5,5.9 | 51.5,5.9 50.83,5.23 37.37,5.23 36.6,6 | 36.6,6 36.6,5.98 35.85,5.23 25.45,5.23 25.18,4.95 20.35,4.95 v19.4,5.9 19.4,5.85 18.5,4.95 13.6,4.95 9.15,9.4 9.15,9.6 9,9.75 9,14.75 8.25,15.5 8.2,15.5
A0PU  (via drill 0.35)
  Top 0.102: MUX.1 17.02,20.6 v17.05,20.6 15.11,22.55 14.99,22.55 14,23.53 v14,25.84 | A0PU.1 20.25,30.95 | 20.25,30.95 20.25,30.2 17.02,30.2 15.75,28.93 15.66,29.02 15.17,29.02 14.53,29.65 v13.95,29.65 | +1.1 20.5,31.58 20.49,31.57 20.49,31.19 20.25,30.95
  Bottom 0.102: v13.95,29.65 13.95,25.84 v14,25.84
A1PU  (via drill 0.35)
  Top 0.102: 17.68,22.8 MUX.2 | 17.68,22.8 17.68,22.85 v17.7,22.85 | A1PU.1 16.2,30.96 | v15.12,25.84 15.12,25.36 17.68,22.8 | +2.1 16.4,31.15 16.21,30.96 16.2,30.96 | 16.2,30.96 16.2,30.45 v15.45,29.7
  Bottom 0.102: v15.45,29.7 15.45,25.84 v15.12,25.84
A2PU  (via drill 0.35)
  Top 0.102: MUX.21 18.98,26.25 v19,26.25 18.67,26.25 17.98,25.57 16.58,25.57 12.05,30.1 | A2PU.1 11.37,30.9 12.05,30.9 | 12.05,30.9 12.05,30.1 | 12.05,30.1 12.1,30.1 | +4.1 12.3,31.6 12.27,31.57 12.27,31.12 12.05,30.9
GND  (via drill 0.35)  (2 unrouted)
  Bottom 0.305: v102.05,11 101.25,10.2 v101.25,8.9 | v83.85,10.95 83,10.1 v83,8.9 | v64.4,10.9 63.55,10.05 v63.55,8.9 | v44.75,10.85 44.75,9.75 v43.9,8.9
  pour Top: 0,0 0,49.9 118,49.9 118,0
IN1LEDR
  Top 0.102: IN1R.2 25.5,14.65 25.8,14.95 26.1,14.95 26.3,14.75 26.3,13.8 36.8,13.8 37.2,14.2 37.2,14.95 37.4,15.15 38.1,15.15 38.35,15.4 IN1LED.A
IN2LEDR
  Top 0.102: IN2R.2 37.8,35.5 37.8,35.2 37.55,34.95 37.2,34.95 37,35.15 37,36.2 36.7,36.5 26.65,36.5 26.15,36 26.15,35 25.8,34.65 25.2,34.65 24.9,34.35 IN2LED.A
MAINLEDR
  Top 0.102: MAIN.A 6.85,17.05 6.65,16.85 6.65,14.25 MAINR.2
N$1  (via drill 0.35)
  other vias: 69.55,31.7
N$2  (via drill 4)
  other vias: 115.3,24.5
N$3  (via drill 0.35)
  other vias: 72.15,31.7
N$13  (via drill 0.35)
  other vias: 30.45,18.45
N$16  (via drill 0.35)
  other vias: 33.15,18.45
N$17  (via drill 0.35)
  other vias: 49.45,18.35
N$18  (via drill 0.35)
  other vias: 52.15,18.35
N$19  (via drill 0.35)
  other vias: 69.15,18.4
N$20  (via drill 0.35)
  other vias: 71.85,18.4
N$21  (via drill 0.35)
  other vias: 88.7,18.5
N$22  (via drill 0.35)
  other vias: 91.35,18.55
N$23  (via drill 0.35)
  other vias: 107.2,18.25
N$24  (via drill 0.35)
  other vias: 109.85,18.3
N$25  (via drill 0.35)
  other vias: 109.95,31.2
N$26  (via drill 0.35)
  other vias: 107.4,31.2
N$27  (via drill 0.35)
  other vias: 91.35,31.45
N$28  (via drill 0.35)
  other vias: 88.7,31.45
N$31  (via drill 0.35)
  other vias: 52.25,31.75
N$32  (via drill 0.35)
  other vias: 49.55,31.75
N$33  (via drill 0.35)
  other vias: 33.05,31.8
N$34  (via drill 0.35)
  other vias: 30.3,31.8
OU1LEDR
  Top 0.102: OUT1R.1 64.25,14.5 64.25,14.85 64.5,15.1 64.85,15.1 65.05,14.9 65.05,13.95 65.35,13.65 75.35,13.65 75.65,13.95 75.65,14.95 75.95,15.25 76.5,15.25 76.8,15.55 OUT1LED.A
OUT0LEDR
  Top 0.102: OUT0LED.A 57.3,15.6 57,15.3 56.4,15.3 56.1,15 56.1,13.85 55.8,13.55 45.6,13.55 45.3,13.85 45.3,14.7 45.1,14.9 44.8,14.9 44.5,14.6 OUT0R.1
OUT2LEDR
  Top 0.102: OUT2R.1 83.6,14.95 83.7,14.95 83.9,15.15 84.25,15.15 84.4,15 84.4,13.85 84.6,13.65 94.75,13.65 95.15,14.05 95.15,15.45 95.35,15.65 96.05,15.65 96.3,15.9 OUT2LED.A
OUT3LEDR
  Top 0.102: OUT3R.1 101.85,15.05 102.1,15.3 102.45,15.3 102.65,15.1 102.65,13.95 102.95,13.65 113,13.65 113.4,14.05 113.4,15.25 113.7,15.55 114.35,15.55 114.6,15.8 OUT3LED.A
OUT4LEDR
  Top 0.102: OUT4LED.A 102.1,34.15 102.25,34.3 103,34.3 103.3,34.6 103.3,35.75 103.7,36.15 113.8,36.15 114.05,35.9 114.05,34.8 114.2,34.65 114.5,34.65 114.85,35 OUT4R.1
OUT5LEDR
  Top 0.102: OUT5R.1 96.35,34.85 96.05,34.55 95.75,34.55 95.55,34.75 95.55,35.8 95.05,36.3 85.5,36.3 84.85,35.65 84.85,34.6 84.5,34.25 83.8,34.25 83.55,34 OUT5LED.A
OUT6LEDR
  Top 0.102: OUT6R.1 77.25,34.85 76.95,34.55 76.65,34.55 76.5,34.7 76.5,35.8 76.2,36.1 66.15,36.1 65.75,35.7 65.75,34.65 65.4,34.3 64.85,34.3 64.6,34.05 OUT6LED.A
OUT7LEDR
  Top 0.102: OUT7R.1 57.25,34.95 57.05,34.75 56.75,34.75 56.5,35 56.5,35.9 56.25,36.15 46.2,36.15 45.85,35.8 45.85,35 45.55,34.7 44.85,34.7 44.5,34.35 OUT7LED.A
RESET
  Top 0.102: MUX.3 18.32,20.6 18.2,20.48 18.2,17.85 18.39,17.66 RESETPU.1
RETRUNGNDIN1
  Top 0.102: IN1LED.C 38.35,14.35 38.8,14.8 39.25,14.8 39.5,14.55 39.5,12.85 38.67,12.02 IN1.8
RETURNGNDIN2
  Top 0.102: IN2.8 24.27,38.04 22.81,36.58 22.81,35.54 23.25,35.1 24.65,35.1 24.9,35.35 IN2LED.C
RETURNGNDOUT1
  Top 0.102: OUT1LED.C 76.8,14.6 77.05,14.85 77.8,14.85 78.2,14.45 78.2,12.75 77.47,12.02 OUT1.8
RETURNGNDOUT2
  Top 0.102: OUT2LED.C 96.35,14.62 96.35,15.05 96.55,15.25 97.4,15.25 97.6,15.05 97.6,13 96.71,12.11 OUT2.8
RETURNGNDOUT3
  Top 0.102: OUT3.8 115.1,12.1 115.85,12.85 115.85,14.8 115.55,15.1 114.85,15.1 114.6,14.85 OUT3LED.C
RETURNGNDOUT4
  Top 0.102: OUT4.8 103.88,37.94 100.31,37.94 99.55,37.19 99.55,35.05 99.85,34.75 101.8,34.75 102.1,35.05 OUT4LED.C
RETURNGNDOUT5
  Top 0.102: OUT5.8 85.45,37.97 82.03,37.97 81.25,37.19 81.25,35.15 81.7,34.7 83.25,34.7 83.55,35 OUT5LED.C
RETURNGNDOUT6
  Top 0.102: OUT6.8 66.55,37.75 63.15,37.75 62.1,36.7 62.1,35.05 62.45,34.7 64.25,34.7 64.6,35.05 OUT6LED.C
RETURNGNDOUT7
  Top 0.102: OUT7.8 43.23,37.92 42.3,36.99 42.3,35.4 42.65,35.05 44.15,35.05 44.5,35.4 OUT7LED.C
RETURNGRNDOUT0
  Top 0.102: OUT0LED.C 57.3,14.6 57.35,14.6 57.55,14.8 58.2,14.8 58.45,14.55 58.45,12.75 57.75,12.05 55.41,12.05 OUT0.8
SC0  (via drill 0.35)
  Top 0.102: OUT0.7 53.21,9.43 52.02,8.24 45.4,8.24 45.25,8.38 45.25,9.05 41.8,12.5 41.8,12.8 v41.8,15.75 | MUX.5 19.87,21.39 19.87,21.03 20.2,20.7 v20.2,20.4
  Bottom 0.102: v41.8,15.75 38.85,18.7 38.85,19.95 38.55,20.25 32.55,20.25 32.26,20.54 31.14,20.54 29.46,18.86 29.46,18.71 27.61,16.86 20.45,16.86 20.16,17.15 20.16,20.36 v20.2,20.4
SC1  (via drill 0.35)
  Top 0.102: OUT1.7 73.67,9.45 72.9,9.45 71.74,8.29 65.04,8.29 64.89,8.44 64.89,9.1 61.5,12.5 61.45,12.54 61.45,13.05 v61.45,16.25 | MUX.7 21.17,21.39 21.17,21.03 21.65,20.55 v21.65,20.5
  Bottom 0.102: v61.45,16.25 60.05,16.25 57.8,18.5 57.8,19.9 57.4,20.3 51.45,20.3 50.99,20.76 39.35,20.76 39.25,20.86 32.86,20.86 32.58,21.15 30.89,21.15 28.85,19.11 28.85,18.96 27.35,17.46 22.14,17.46 21.6,18.01 21.6,20.45 v21.65,20.5
SC2  (via drill 0.35)
  Top 0.102: OUT2.7 92.23,9.57 91.04,8.38 84.42,8.38 84.27,8.53 84.27,9.08 80.45,12.9 v80.45,16.1 | MUX.9 22.47,21.39 22.47,21.03 22.62,20.88 22.77,20.88 v23.2,20.45
  Bottom 0.102: v80.45,16.1 76.05,20.5 70.3,20.5 70.2,20.6 69.61,20 58.41,20 58.41,20.5 58,20.91 51.8,20.96 51.3,21.47 33.12,21.47 32.83,21.76 30.64,21.76 26.95,18.07 23.67,18.07 23.05,18.7 23.05,20.3 v23.2,20.45
SC3  (via drill 0.35)
  Top 0.102: OUT3.7 110.52,9.57 109.33,8.38 102.71,8.38 102.56,8.53 102.56,9.04 98.85,12.75 v98.85,16.15 | MUX.11 23.77,21.39 23.77,21.03 23.92,20.88 24.07,20.88 v24.65,20.45
  Bottom 0.102: v24.65,20.45 24.63,20.43 24.63,19.15 25.1,18.68 26.75,18.68 27.63,19.57 27.63,19.62 30.38,22.37 33.08,22.37 33.37,22.08 51.64,22.08 52.15,21.57 58.25,21.52 | 58.25,21.52 | 58.25,21.52 59.16,20.61 69.13,20.61 69.73,21.21 76.2,21.21 77.46,19.95 88.91,19.95 89.59,20.64 95.59,20.64 97.25,18.98 97.25,17.85 98.85,16.25 v98.85,16.15
SC4  (via drill 0.35)
  Top 0.102: v24.2,28.6 24.18,28.59 23.52,27.94 MUX.14 | OUT4.7 102.3,40.37 99.34,37.41 | 99.34,37.41 | 99.34,37.41 99.25,37.31 99.25,34.62 99.3,34.57 v99.3,33.75
  Bottom 0.102: v99.3,33.75 99.3,32.6 96.3,29.6 77.75,29.6 76.18,28.03 30.39,28.03 28.95,29.47 24.55,29.47 24.2,29.12 v24.2,28.6
SC5  (via drill 0.35)
  Top 0.102: OUT5.7 84.05,40.42 80.57,36.93 80.57,33.82 v80.55,33.8 | MUX.16 22.23,28.02 v22.45,28.75
  Bottom 0.102: v80.55,33.8 78,31.25 78,31.2 75.44,28.64 30.65,28.64 29.21,30.08 22.95,30.08 22.4,29.53 22.4,28.8 v22.45,28.75
SC6  (via drill 0.35)
  Top 0.102: OUT6.7 65.19,40.31 61.69,36.81 v61.69,33.76 v61.7,33.75 | MUX.18 20.93,28.02 v21,28.8
  Bottom 0.102: v61.7,33.75 61.7,33.45 57.5,29.25 30.9,29.25 29.46,30.69 21.25,30.69 20.96,30.4 20.96,28.84 v21,28.8
SC7  (via drill 0.35)
  Top 0.102: OUT7.7 45.34,40.46 41.84,36.96 v41.84,34.21 v41.85,34.2 | v19.4,28.75 19.4,27.69 MUX.20
  Bottom 0.102: v41.85,34.2 37.67,30.02 31.12,30.02 29.83,31.3 19.85,31.3 19.35,30.8 19.35,28.8 v19.4,28.75
SCL  (via drill 0.35)
  Top 0.102: MUX.22 18.32,28.57 v18.3,28.6 18.3,29.59 21.82,29.59 22.5,30.27 22.5,36.7 26.3,40.5 28.09,40.5 IN2.7 | SCLPUR.1 17.75,11.51 18.1,11.15 18.3,11.15 18.45,11.3 18.45,12.7 17.75,13.4 v17.75,13.65
  Bottom 0.102: v18.3,28.6 16.31,26.51 16.31,24.88 15.4,23.98 15.4,15.5 v17.75,13.65 21.91,8.29 33.04,8.29 34.23,9.48 IN1.7
SCLPU
  Top 0.102: SCLPUR.2 17.75,10.55 17.45,10.85 16.95,10.85 16.45,10.35 16.45,7.78 16.9,7.33 SCLPU.1
SD0  (via drill 0.35)
  Top 0.102: OUT0.2 42.76,11.97 42.17,12.57 42.17,14.38 v42.48,14.7 | MUX.4 19.22,21.88 19.22,22.23 19.6,22.61 v19.6,23.05
  Bottom 0.102: v42.48,14.7 42.13,15.05 41.5,15.05 38.45,18.1 38.45,19.7 38.25,19.9 32.47,19.9 32.13,20.23 31.27,20.23 29.77,18.73 29.77,18.52 27.8,16.55 19.55,16.55 18.9,17.2 18.9,20.18 19.03,20.32 19.03,22.48 v19.6,23.05
SD1  (via drill 0.35)
  Top 0.102: OUT1.2 62.4,12.02 61.8,12.62 61.8,14.4 v62.15,14.75 | MUX.6 20.27,22.27 v21.05,23.05
  Bottom 0.102: v62.15,14.75 61.1,14.75 57.5,18.35 57.5,19.6 57.1,20 51.27,20 51.03,20.23 39.3,20.23 38.98,20.55 32.74,20.55 32.45,20.84 31.02,20.84 29.16,18.98 29.16,18.84 27.48,17.16 21.18,17.16 20.97,17.38 20.97,20.78 21.05,20.87 v21.05,23.05
SD2  (via drill 0.35)
  Top 0.102: v22.3,23.05 22.32,23.05 21.57,22.31 MUX.8 | OUT2.2 81.67,12.11 80.79,12.99 80.79,14.46 v81.13,14.8
  Bottom 0.102: v81.13,14.8 80.78,14.8 79.77,15.82 79.77,15.88 75.47,20.18 70.22,20.18 69.82,19.78 69.82,19.77 69.75,19.7 58.2,19.7 58.11,19.79 58.11,20.37 57.87,20.61 51.61,20.61 51.05,21.16 32.99,21.16 32.7,21.45 30.76,21.45 28.55,19.24 28.55,19.12 27.2,17.77 22.95,17.77 22.27,18.45 22.27,20.15 22.33,20.22 22.33,20.78 22.3,20.82 v22.3,23.05
SD3  (via drill 0.35)
  Top 0.102: MUX.10 23.12,21.88 23.12,22.23 23.65,22.76 v23.65,23 | v99.53,14.45 99.53,12.67 100.09,12.11 OUT3.2
  Bottom 0.102: v99.53,14.45 96.95,17.03 96.95,18.85 95.47,20.33 89.72,20.33 89.03,19.65 77.33,19.65 76.08,20.91 70.07,20.91 69.97,20.8 69.75,20.8 69.26,20.31 58.72,20.31 58.72,20.62 58.12,21.22 | 58.12,21.22 | v23.65,23 23.65,20.97 23.88,20.73 23.88,20.17 23.8,20.08 23.8,18.88 24.3,18.38 26.83,18.38 30.51,22.06 32.95,22.06 33.24,21.77 51.44,21.77 51.95,21.27 52.02,21.27 58.12,21.22
SD4  (via drill 0.35)
  Top 0.102: OUT4.2 111.61,40.79 110.84,41.56 110.79,41.56 110.75,41.6 103.1,41.6 98.55,37.05 v98.55,34.7 | MUX.13 24.18,26.43 v23.75,26
  Bottom 0.102: v23.75,26 23.75,27.18 24.88,28.32 24.88,28.85 25.2,29.17 28.83,29.17 30.27,27.73 76.4,27.73 77.97,29.3 96.43,29.3 99.98,32.85 99.98,34.03 99.58,34.43 98.82,34.43 v98.55,34.7
SD5  (via drill 0.35)
  Top 0.102: OUT5.2 93.08,37.96 93.08,40.91 92.38,41.61 86.31,41.61 86.1,41.4 84.6,41.4 80.25,37.05 80.25,35.45 v79.8,35 | MUX.15 22.88,26.48 v22.4,26
  Bottom 0.102: v79.8,35 79.8,34.48 80.83,34.48 81.23,34.08 81.23,33.52 76.05,28.34 30.52,28.34 29.08,29.78 23.6,29.78 23.1,29.28 23.1,29.07 23.13,29.03 23.13,28.47 22.4,27.73 v22.4,26
SD6  (via drill 0.35)
  Top 0.102: MUX.17 21.57,26.32 v21.25,26 | OUT6.2 74.11,37.85 74.11,40.8 73.41,41.5 65.9,41.5 61.1,36.7 61.1,35.15 v61,35.05
  Bottom 0.102: v61,35.05 61,34.43 61.98,34.43 62.38,34.03 62.38,33.47 57.86,28.95 30.77,28.95 29.33,30.39 21.95,30.39 21.6,30.04 21.6,29.17 21.68,29.08 21.68,28.52 21.25,28.08 v21.25,26
SD7  (via drill 0.35)
  Top 0.102: OUT7.2 54.05,38 54.05,40.95 53.35,41.65 47.28,41.65 47.23,41.6 46.05,41.6 41.5,37.05 41.5,36.8 41.16,36.46 v41.16,35.4 | MUX.19 20.27,26.23 v20.05,26
  Bottom 0.102: v41.16,35.4 41.67,34.88 42.13,34.88 42.53,34.48 42.53,33.92 38.33,29.71 30.99,29.71 29.71,31 20.6,31 20.3,30.7 20.3,26.25 v20.05,26
SDA  (via drill 0.35)
  Top 0.102: v17.7,26.25 17.7,27.43 17.68,27.45 MUX.23 17.68,27.88 17.18,28.37 17.18,29.89 21.7,29.89 22.2,30.4 22.2,36.83 27.14,41.77 29.02,41.77 29.1,41.85 33.67,41.85 34.45,41.07 34.45,38.12 IN2.2 | IN1.2 27.67,10.96 21.15,10.96 20.66,11.45 SDAPUR.1 20.66,11.36 20.41,11.11 19.9,11.11 19.8,11.21 19.8,12.55 20.65,13.4 v20.65,13.55
  Bottom 0.102: v20.65,13.55 17.85,16 16.35,16 15.95,16.4 15.95,22.35 17.6,24 17.6,26.15 v17.7,26.25
SDAPU
  Top 0.102: SDAPU.1 20.32,7.35 19.8,7.35 19.5,7.65 19.5,10.45 19.85,10.8 20.31,10.8 20.66,10.45 SDAPUR.2

### Text on the board
tSilk: I2C ADDRESS / SELECTION / DEFAULT 0X70 | 5V MAX | +4 | +2 | +1 | Act | Act | Act | Act | Act | PASS | OUT7 | OUT6 | OUT5 | OUT4 | IN | OUT0 | OUT1 | OUT2 | OUT3 | Act | Act | Act | Act | Act | On | Created By / Lynton Brown / 11/27/2017 | SCL | SDA | PULL UP